# EAGLE design fsr_endstop_small_mod0.1 (EAGLE 6.6.0)
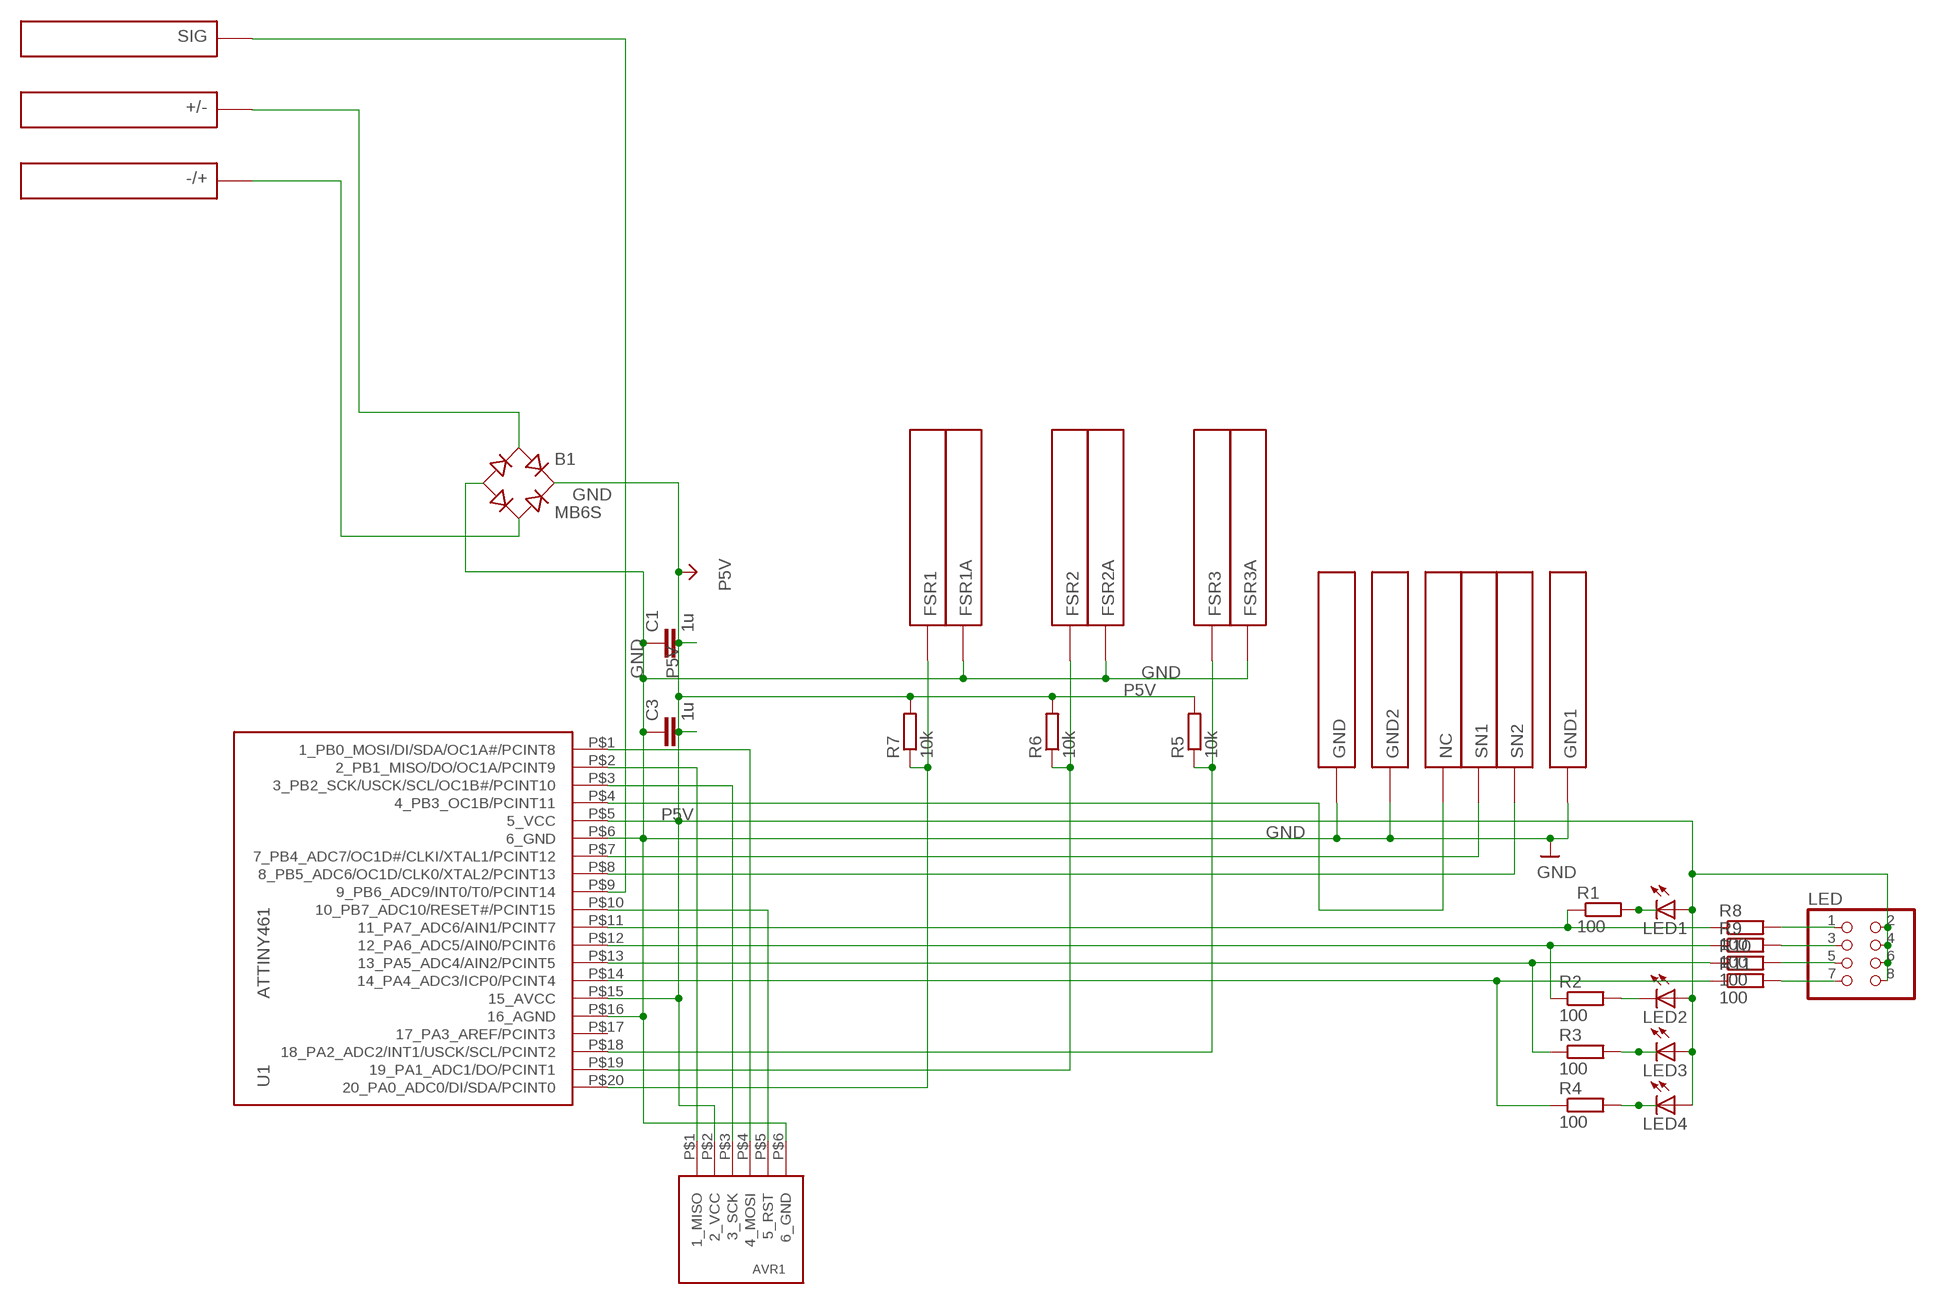
[diagram p0: schematic, sheet 1]

## Parts
+/-  PIN1.2MM  [PIN_1.2MM]
-/+  PIN1.2MM  [PIN_1.2MM]
AVR1  AVR6  [AVR6]
B1  MB6S  [SOIC-4]
C1  1u  C-EUC0805  [C0805]
C3  1u  C-EUC0805  [C0805]
FSR1  PIN1.2MM  [PIN_1.2MM]
FSR1A  PIN1.2MM  [PIN_1.2MM]
FSR2  PIN1.2MM  [PIN_1.2MM]
FSR2A  PIN1.2MM  [PIN_1.2MM]
FSR3  PIN1.2MM  [PIN_1.2MM]
FSR3A  PIN1.2MM  [PIN_1.2MM]
GND  PIN1.2MM  [PIN_1.2MM]
GND1  PIN1.2MM  [PIN_1.2MM]
GND2  PIN1.2MM  [PIN_1.2MM]
LED  PINHD-2X4  [2X04]
LED1  LEDCHIP-LED0805  [CHIP-LED0805]
LED2  LEDCHIP-LED0805  [CHIP-LED0805]
LED3  LEDCHIP-LED0805  [CHIP-LED0805]
LED4  LEDCHIP-LED0805  [CHIP-LED0805]
NC  PIN1.2MM  [PIN_1.2MM]
R1  100  R-EU_R0805  [R0805]
R2  100  R-EU_R0805  [R0805]
R3  100  R-EU_R0805  [R0805]
R4  100  R-EU_R0805  [R0805]
R5  10k  R-EU_R0805  [R0805]
R6  10k  R-EU_R0805  [R0805]
R7  10k  R-EU_R0805  [R0805]
R8  100  R-EU_R0805  [R0805]
R9  100  R-EU_R0805  [R0805]
R10  100  R-EU_R0805  [R0805]
R11  100  R-EU_R0805  [R0805]
SIG  PIN1.2MM  [PIN_1.2MM]
SN1  PIN1.2MM  [PIN_1.2MM]
SN2  PIN1.2MM  [PIN_1.2MM]
U1  ATTINY461  [SOIC-20]

## Nets
GND: AVR1.P$6(6_GND) B1.- C1.1 C3.1 FSR1A.P$1 FSR2A.P$1 FSR3A.P$1 GND1.P$1 GND2.P$1 GND.P$1 U1.P$6(6_GND) U1.P$16(16_AGND)
N$1: AVR1.P$4(4_MOSI) U1.P$1(1_PB0_MOSI/DI/SDA/OC1A#/PCINT8)
N$2: AVR1.P$1(1_MISO) U1.P$2(2_PB1_MISO/DO/OC1A/PCINT9)
N$3: -/+.P$1 B1.~2(AC2)
N$4: +/-.P$1 B1.~1(AC1)
N$5: AVR1.P$3(3_SCK) U1.P$3(3_PB2_SCK/USCK/SCL/OC1B#/PCINT10)
N$6: AVR1.P$5(5_RST) U1.P$10(10_PB7_ADC10/RESET#/PCINT15)
N$7: FSR1.P$1 R7.1 U1.P$20(20_PA0_ADC0/DI/SDA/PCINT0)
N$8: FSR2.P$1 R6.1 U1.P$19(19_PA1_ADC1/DO/PCINT1)
N$9: FSR3.P$1 R5.1 U1.P$18(18_PA2_ADC2/INT1/USCK/SCL/PCINT2)
N$10: R4.1 R11.1 U1.P$14(14_PA4_ADC3/ICP0/PCINT4)
N$11: R3.1 R10.1 U1.P$13(13_PA5_ADC4/AIN2/PCINT5)
N$12: R2.1 R9.1 U1.P$12(12_PA6_ADC5/AIN0/PCINT6)
N$13: R1.1 R8.1 U1.P$11(11_PA7_ADC6/AIN1/PCINT7)
N$14: SIG.P$1 U1.P$9(9_PB6_ADC9/INT0/T0/PCINT14)
N$15: NC.P$1 U1.P$4(4_PB3_OC1B/PCINT11)
N$16: SN2.P$1 U1.P$8(8_PB5_ADC6/OC1D/CLK0/XTAL2/PCINT13)
N$17: SN1.P$1 U1.P$7(7_PB4_ADC7/OC1D#/CLKI/XTAL1/PCINT12)
N$18: LED1.C R1.2
N$19: LED2.C R2.2
N$20: LED3.C R3.2
N$21: LED4.C R4.2
N$22: LED.7 R11.2
N$24: LED.1 R8.2
N$25: LED.3 R9.2
N$26: LED.5 R10.2
P5V: AVR1.P$2(2_VCC) B1.+ C1.2 C3.2 LED1.A LED2.A LED3.A LED4.A LED.2 LED.4 LED.6 LED.8 R5.2 R6.2 R7.2 U1.P$5(5_VCC) U1.P$15(15_AVCC)
Unconnected: U1.P$17(17_PA3_AREF/PCINT3)

## Library data of the parts
+/- -/+ FSR1 FSR1A FSR2 FSR2A FSR3 FSR3A GND GND1 GND2 NC SIG SN1 SN2 = _sg_lib:PIN
AVR1 = _sg_misc:AVR6
B1 = rectifier:MB*S: Bridge Rectifier Source: http://www.fairchildsemi.com/ds/MB/MB6S.pdf
C1 C3 = schlager_passiv:C-EU: CAPACITOR, European symbol
LED = pinhead:PINHD-2X4: PIN HEADER
LED1-LED4 = led:LED: LED OSRAM: - CHIPLED LG R971, LG N971, LY N971, LG Q971, LY Q971, LO R971, LY R971 LH N974, LH R974 LS Q976, LO Q976, LY Q976 LO Q996 - Hyper CHIPLED LW Q18S LB Q993, LB Q99A, LB R99A - SideLED LS A670, LO A670, LY A670, LG A670, LP A670 LB A673, LV A673, LT A673, LW A673 LH A674 LY A675 LS A676, LA A676, LO A676, LY A676, LW A676 LS A679, LY A679, LG A679 - Hyper Micro SIDELED® LS Y876, LA Y876, LO Y876, LY Y876 LT Y87S - SmartLED LW L88C, LW L88S LB L89C, LB L89S, LG L890 LS L89K, LO L89K, LY L89K LS L896, LA L896, LO L896, LY L896 - TOPLED LS T670, LO T670, LY T670, LG T670, LP T670 LSG T670, LSP T670, LSY T670, LOP T670, LYG T670 LG T671, LOG T671, LSG T671 LB T673, LV T673, LT T673, LW T673 LH T674 LS T676, LA T676, LO T676, LY T676, LB T676, LH T676, LSB T676, LW T676 LB T67C, LV T67C, LT T67C, LS T67K, LO T67K, LY T67K, LW E67C LS E67B, LA E67B, LO E67B, LY E67B, LB E67C, LV E67C, LT E67C LW T67C LS T679, LY T679, LG T679 LS T770, LO T770, LY T770, LG T770, LP T770 LB T773, LV T773, LT T773, LW T773 LH T774 LS E675, LA E675, LY E675, LS T675 LS T776, LA T776, LO T776, LY T776, LB T776 LHGB T686 LT T68C, LB T68C - Hyper Mini TOPLED® LB M676 - Mini TOPLED Santana® LG M470 LS M47K, LO M47K, LY M47K Source: http://www.osram.convergy.de LUXEON: - LUMILED® LXK2-PW12-R00, LXK2-PW12-S00, LXK2-PW14-U00, LXK2-PW14-V00 LXK2-PM12-R00, LXK2-PM12-S00, LXK2-PM14-U00 LXK2-PE12-Q00, LXK2-PE12-R00, LXK2-PE12-S00, LXK2-PE14-T00, LXK2-PE14-U00 LXK2-PB12-K00, LXK2-PB12-L00, LXK2-PB12-M00, LXK2-PB14-N00, LXK2-PB14-P00, LXK2-PB14-Q00 LXK2-PR12-L00, LXK2-PR12-M00, LXK2-PR14-Q00, LXK2-PR14-R00 LXK2-PD12-Q00, LXK2-PD12-R00, LXK2-PD12-S00 LXK2-PH12-R00, LXK2-PH12-S00 LXK2-PL12-P00, LXK2-PL12-Q00, LXK2-PL12-R00 Source: www.luxeon.com KINGBRIGHT: KA-3528ASYC Source: www.kingbright.com
R1-R11 = schlager_passiv:R-EU_: RESISTOR, European symbol
U1 = _sg_misc:ATTINY461

## Board
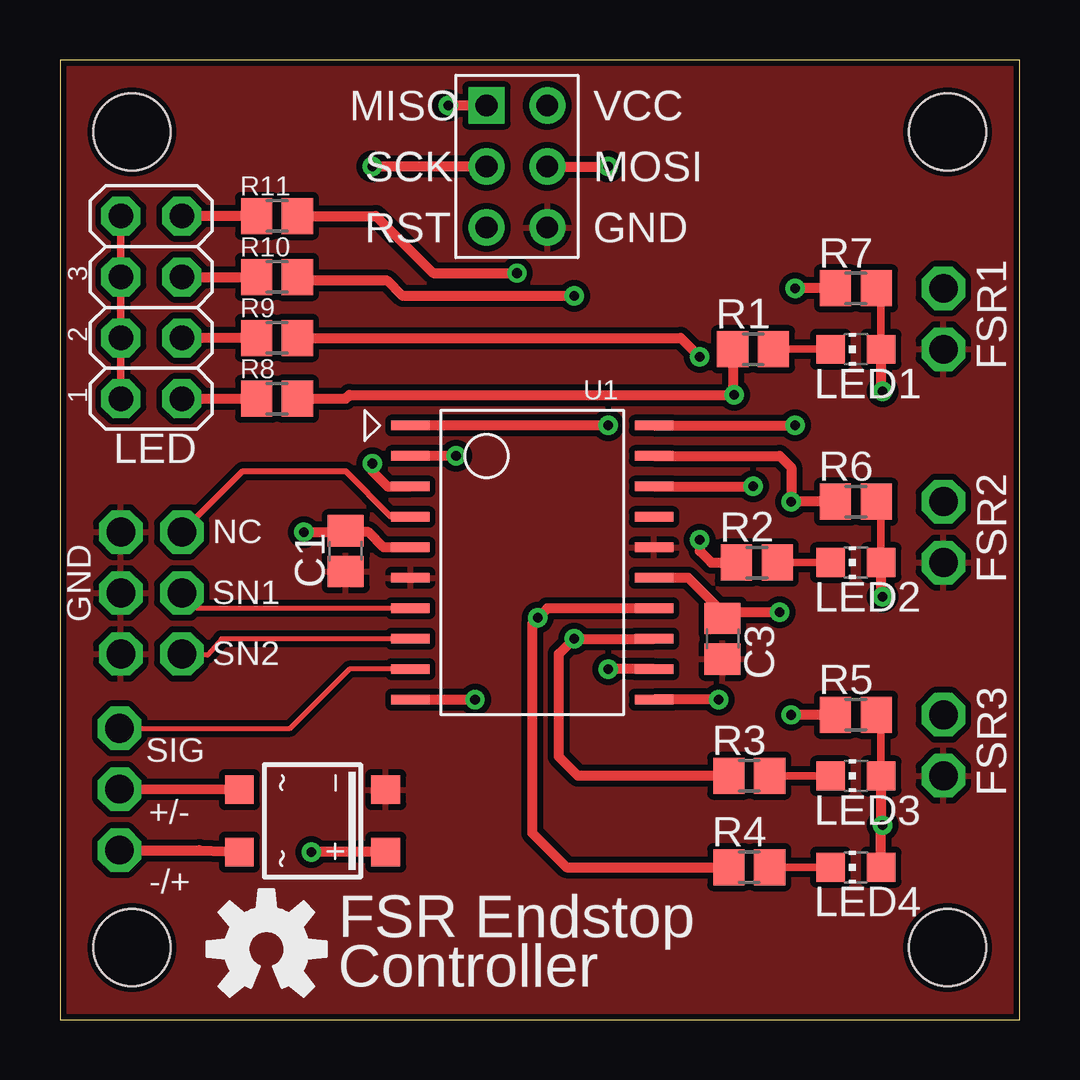
[diagram p1: board, top side]
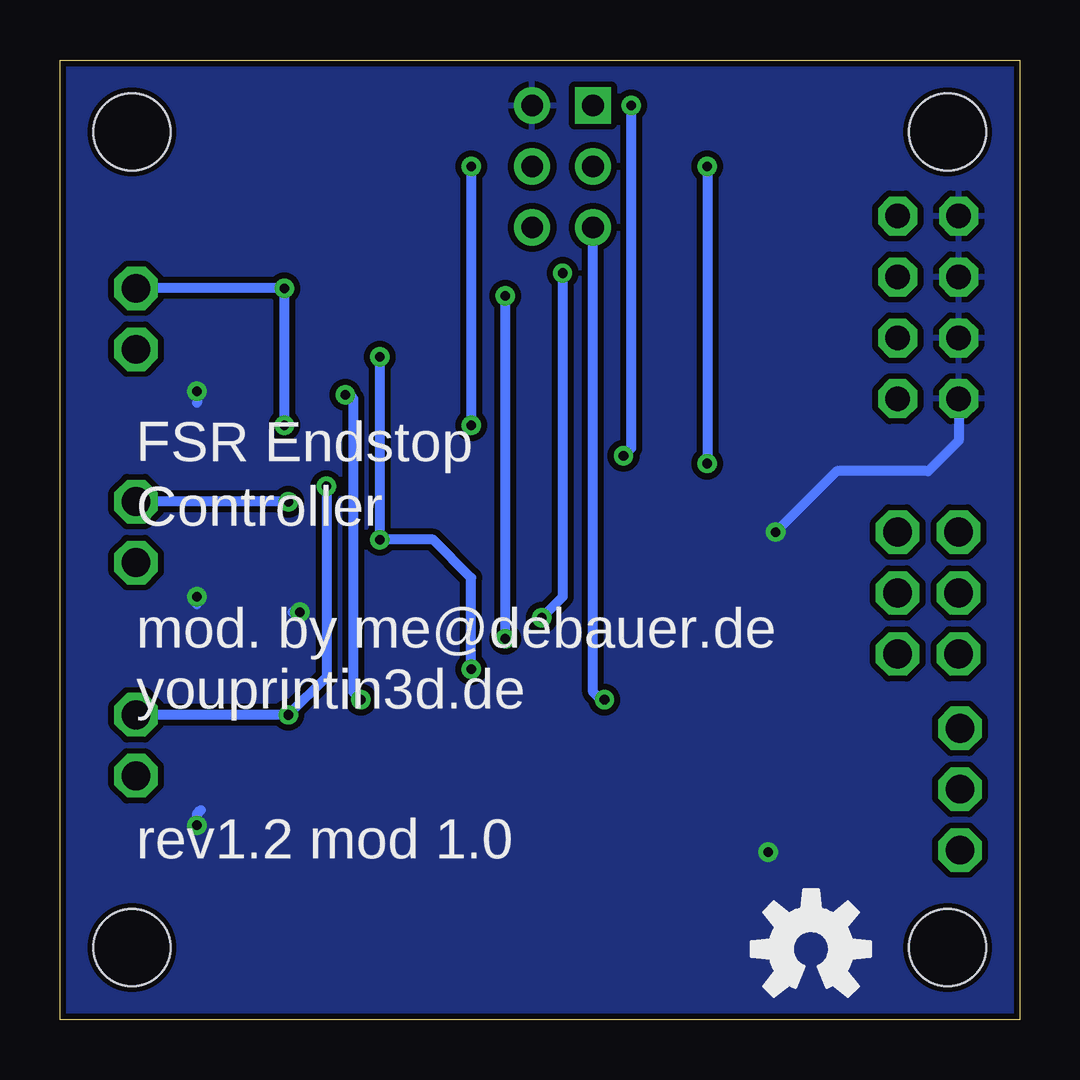
[diagram p2: board, bottom side, seen from below]

Size 40 x 40 mm. Coordinates in mm from the lower left corner, seen from the top.
Outline: 0,40 0,0 40,0 40,40 0,40
Copper layers (1*16): Top 0.035mm / dielectric 1.5mm / Bottom 0.035mm
Design rules "DFRobot_Eagle_Rule_v0.4": minimum track width 6mil, minimum drill 12mil, track to track 6mil, track to pad 6mil, pad to pad 6mil, via to via 6mil, smd to smd 0mil, copper to edge 10mil, drill to drill 10mil, minimum pad ring 12mil, minimum via ring 8mil, stop-mask expansion 2mil, vias tented up to drill 25mil, thermal gap 10mil
Holes 3.2 mm at 3,37 37,37 37,3 3,3

### Footprints (pad centres in the part's own frame; a part is rotated, then mirrored left to right if it is on the bottom)
PIN_1.2MM = drill 1.2 octagon: P$1 0,0
AVR6 = drill 0.9 square: P$1 -1.27,2.54 | drill 0.9: P$2 1.27,2.54; P$3 -1.27,0; P$4 1.27,0; P$5 -1.27,-2.54; P$6 1.27,-2.54
SOIC-4 = smd 1.2 x 1.2: + 1.3,3.05; - -1.3,3.05; ~1 -1.3,-3.05; ~2 1.3,-3.05
C0805 = smd 1.3 x 1.5: 1 -0.85,0; 2 0.85,0
2X04 = drill 1.016 octagon: 1 -3.81,-1.27; 2 -3.81,1.27; 3 -1.27,-1.27; 4 -1.27,1.27; 5 1.27,-1.27; 6 1.27,1.27; 7 3.81,-1.27; 8 3.81,1.27
CHIP-LED0805 = smd 1.2 x 1.2: A 0,-1.05; C 0,1.05
R0805 = smd 1.3 x 1.5: 1 -0.85,0; 2 0.85,0
SOIC-20 = smd 1.6 x 0.4: P$1 -5.08,5.715; P$2 -5.08,4.445; P$3 -5.08,3.175; P$4 -5.08,1.905; P$5 -5.08,0.635; P$6 -5.08,-0.635; P$7 -5.08,-1.905; P$8 -5.08,-3.175; P$9 -5.08,-4.445; P$10 -5.08,-5.715; P$11 5.08,-5.715; P$12 5.08,-4.445; P$13 5.08,-3.175; P$14 5.08,-1.905; P$15 5.08,-0.635; P$16 5.08,0.635; P$17 5.08,1.905; P$18 5.08,3.175; P$19 5.08,4.445; P$20 5.08,5.715

### Placement (x,y rotation side)
+/-  2.48,9.6 0 top
-/+  2.48,7.06 0 top
AVR1  19.05,35.56 0 top
B1  10.53,8.28 270 top
C1  11.91,19.53 90 top
C3  27.62,15.88 90 top
FSR1  36.83,30.48 180 top
FSR1A  36.83,27.94 180 top
FSR2  36.83,21.59 180 top
FSR2A  36.83,19.05 180 top
FSR3  36.83,12.7 180 top
FSR3A  36.83,10.16 180 top
GND  2.54,20.32 90 top
GND1  2.54,15.24 0 top
GND2  2.54,17.78 270 top
LED  3.81,29.69 90 top
LED1  33.18,27.94 90 top
LED2  33.18,19.05 90 top
LED3  33.18,10.16 90 top
LED4  33.18,6.35 90 top
NC  5.08,20.32 0 top
R1  28.89,27.94 0 top
R2  29.05,19.05 0 top
R3  28.73,10.16 0 top
R4  28.73,6.35 0 top
R5  33.18,12.7 0 top
R6  33.18,21.59 0 top
R7  33.18,30.48 0 top
R8  9.05,25.88 180 top
R9  9.05,28.42 180 top
R10  9.05,30.96 180 top
R11  9.05,33.5 180 top
SIG  2.48,12.14 0 top
SN1  5.08,17.78 0 top
SN2  5.08,15.24 0 top
U1  19.68,19.05 0 top
U$1  [OSHW-LOGO-M]  8.69,2.93 0 bottom
U$2  [OSHW-LOGO-M]  8.61,2.93 0 top

### Tracks (layer width: path | path; a pad name or v marks a point on that pad's centre or on a via)
GND
  pour Top (isolate 0.254): 14.12,49.68 63.65,50.95 64.92,-6.65 -12.29,-7.92 -13.56,43.89
N$1  (via drill 0.4)
  Top 0.406: AVR1.P$4 v22.86,35.56 | v22.86,24.77 U1.P$1
  Bottom 0.406: v22.86,35.56 v22.86,24.77
N$2  (via drill 0.4)
  Top 0.406: AVR1.P$1 v16.19,38.1 | v16.51,23.5 U1.P$2
  Bottom 0.406: v16.19,38.1 16.19,23.81 v16.51,23.5
N$3
  Top 0.406: -/+.P$1 5.81,7.06 B1.~2
N$4
  Top 0.406: B1.~1 +/-.P$1
N$5  (via drill 0.4)
  Top 0.406: AVR1.P$3 v13.02,35.56 | v13.02,23.18 13.02,22.86 13.65,22.23 U1.P$3
  Bottom 0.406: v13.02,35.56 v13.02,23.18
N$6  (via drill 0.4)
  Top 0.406: U1.P$10 v17.3,13.34
  Bottom 0.406: v17.3,13.34 17.46,13.34 17.78,13.65 AVR1.P$5
N$7  (via drill 0.4)
  Top 0.406: R7.1 v30.64,30.48 | U1.P$20 v30.64,24.77
  Bottom 0.406: FSR1.P$1 v30.64,30.48 v30.64,24.77
N$8  (via drill 0.4)
  Top 0.406: R6.1 v30.48,21.59 30.48,23.02 30,23.5 U1.P$19
  Bottom 0.406: v30.48,21.59 FSR2.P$1
N$9  (via drill 0.4)
  Top 0.406: R5.1 v30.48,12.7 | U1.P$18 v28.89,22.23
  Bottom 0.406: FSR3.P$1 v30.48,12.7 28.89,14.29 v28.89,22.23
N$10  (via drill 0.4)
  Top 0.406: U1.P$14 20.32,17.14 v19.92,16.75 19.68,16.51 19.68,7.78 21.11,6.35 R4.1 | v19.05,31.11 15.56,31.11 13.18,33.5 R11.1
  Bottom 0.406: v19.05,31.11 19.05,17.62 v19.92,16.75
N$11  (via drill 0.4)
  Top 0.406: U1.P$13 v21.43,15.88 20.8,15.24 20.8,10.95 21.59,10.16 R3.1 | v21.43,30.16 14.29,30.16 13.65,30.8 10.06,30.8 R10.1
  Bottom 0.406: v21.43,15.88 v21.43,30.16
N$12  (via drill 0.4)
  Top 0.406: v26.67,20 26.67,19.53 27.15,19.05 R2.1 | U1.P$12 v22.86,14.61 | R9.1 25.88,28.42 v26.67,27.62
  Bottom 0.406: v26.67,27.62 v26.67,20 24.45,20 22.86,18.41 v22.86,14.61
N$13  (via drill 0.4)
  Top 0.406: R1.1 28.04,26.09 v28.1,26.04 12.06,26.04 11.91,25.88 R8.1 | v27.46,13.34 U1.P$11
  Bottom 0.406: v28.1,26.04 27.94,26.04 27.78,25.88 27.78,13.65 v27.46,13.34
N$14
  Top 0.203: U1.P$9 12.06,14.61 9.6,12.14 SIG.P$1
N$15
  Top 0.254: NC.P$1 7.62,22.86 11.91,22.86 13.81,20.95 U1.P$4
N$16
  Top 0.203: U1.P$8 6.73,15.88 6.15,15.19 5.13,15.19 SN2.P$1
N$17
  Top 0.203: U1.P$7 5.71,17.14 SN1.P$1
N$18
  Top 0.305: LED1.C R1.2
N$19
  Top 0.305: LED2.C R2.2
N$20
  Top 0.305: R3.2 LED3.C
N$21
  Top 0.305: LED4.C R4.2
N$22
  Top 0.406: R11.2 LED.7
N$24
  Top 0.406: LED.1 R8.2
N$25
  Top 0.406: R9.2 LED.3
N$26
  Top 0.406: LED.5 R10.2
P5V  (via drill 0.4)
  Top 0.305: LED.8 LED.6 LED.4 LED.2 | LED3.A 34.23,12.5 R5.2 | LED2.A 34.23,21.39 R6.2 34.23,21.79 | LED1.A 34.23,30.28 R7.2
  Top 0.406: v10.16,20.32 11.85,20.32 C1.2 11.96,20.32 12.86,20.32 13.49,19.68 U1.P$5 | LED1.A 34.23,26.25 v34.29,26.19 | LED2.A 34.23,17.68 v34.29,17.62 | C3.2 27.62,16.99 | 27.62,16.99 26.19,18.41 U1.P$15 | 27.62,16.99 v30,16.99 | LED4.A 34.23,8.04 v34.29,8.1 34.23,8.16 LED3.A | B1.+ 12.54,6.98 v10.48,6.99
  Bottom 0.406: LED.2 2.54,24.13 3.81,22.86 7.62,22.86 v10.16,20.32 | v34.29,26.19 34.29,25.72 | v34.29,17.62 34.29,17.3 | v30,16.99 30.32,16.99 | v34.29,8.1 34.29,8.57 34.13,8.73 | v10.48,6.99 10.64,6.99
  pour Bottom (isolate 0.254): 48.06,48.41 48.06,-3.96 -11.48,-3.96 -11.48,48.06

### Text on the board
tPlace: 3 | 2 | 1 | FSR Endstop | Controller
bPlace: FSR Endstop | Controller | mod. by me@debauer.de | youprintin3d.de | rev1.2 mod 1.0